# Altium schematic sheet power-v2v5.SchDoc: Power 2.5V
size Letter; CheckedBy: J. Brinton; CompanyName: Signal Laboratories, Inc.; DrawnBy: J. Brinton; Engineer: J. Brinton; Address1: 3479 Edison Way; Address2: Menlo Park CA 94025; Address3: +1 (877) 778-8435; Address4: siglabs.com; Revision: 3; SheetNumber: 43; SheetTotal: 49
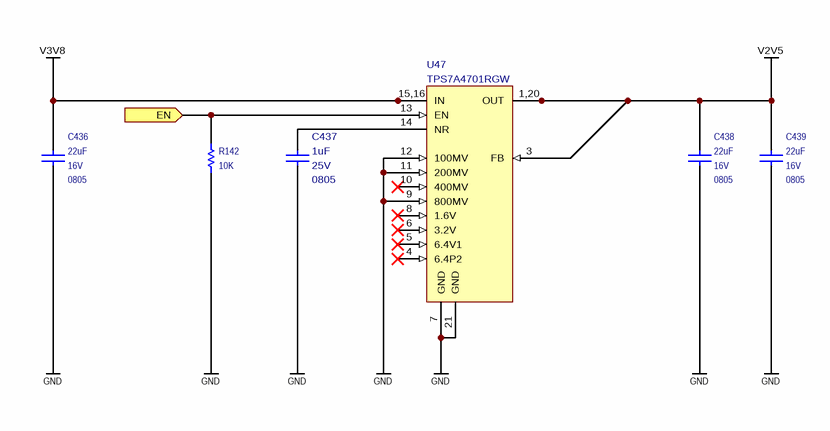
[diagram p0: power-v2v5.SchDoc]

## Parts
C436  value 22uF  Voltage: 16V  Package: 0805  [CAPC200X125X145L45N]  (hidden comment: CL21A226KOQNNNE)
C437  value 1uF  Package: 0805  Voltage: 25V  [CAPC200X125X145L45N]  (hidden comment: TMK212B7105KG)
C438  value 22uF  Voltage: 16V  Package: 0805  [CAPC200X125X145L45N]  (hidden comment: CL21A226KOQNNNE)
C439  value 22uF  Voltage: 16V  Package: 0805  [CAPC200X125X145L45N]  (hidden comment: CL21A226KOQNNNE)
R142  value 10K  [RESC1005X40N]  (hidden comment: ERJ-2RKF1002X)
U47  TPS7A4701RGW  [QFN65P500X500X100-21N]

## Ports
EN (in)

## Nets
GND: C436.1 C437.2 C438.1 C439.1 R142.2 U47.7(GND) U47.9(800MV) U47.11(200MV) U47.12(100MV) U47.21(GND)
V2V5: C438.2 C439.2 U47.1(OUT) U47.3(FB) U47.20(OUT)
V3V8: C436.2 U47.15(IN) U47.16(IN)
EN: R142.1 U47.13(EN) ; port EN
NetC437_1: C437.1 U47.14(NR)

Not connected (* = marked no-connect by the designer): U47 4(6.4P2)* 5(6.4V1)* 6(3.2V)* 8(1.6V)* 10(400MV)*

## Notes on the sheet
- Title
- Engineer
- Revision
- Drawn By
- Checked By
- Date
- Sheet
- of
- (in symbol TPS7A4701RGW_1) 15,16; 1,20

## Library data of the parts
C436 C438 C439 = CAP 0603: Ceramic Capacitor 22uF ±10% 16V X5R 0805; Manufacturer: Samsung; Tr: -55:85; Manufacturer P/N: CL21A226KOQNNNE; Tolerance: ±10%
C437 = TMK212B7105KG: Ceramic Capacitor 1uF ±10% 25V X7R 0805; Manufacturer: Taiyo Yuden; Manufacturer P/N: TMK212B7105KG; Tolerance: ±10%; Tr: *
R142 = RES 0402: Thick Film Resistor 10k ±1% 0.1W 50V 0402; Manufacturer: Panasonic; Tr: -55:155; Package: 0402; Manufacturer P/N: ERJ-2RKF1002X; Tolerance: ±1%
U47 = TPS7A4701RGW_1: Low-Dropout Linear Regulator 20-VQFN; Manufacturer: Texas Instruments; Manufacturer P/N: TPS7A4701RGW; Package: VQFN-20